# EAGLE design HARE - 3PDT Breakout Schematic v1.0 (EAGLE 8.4.1)
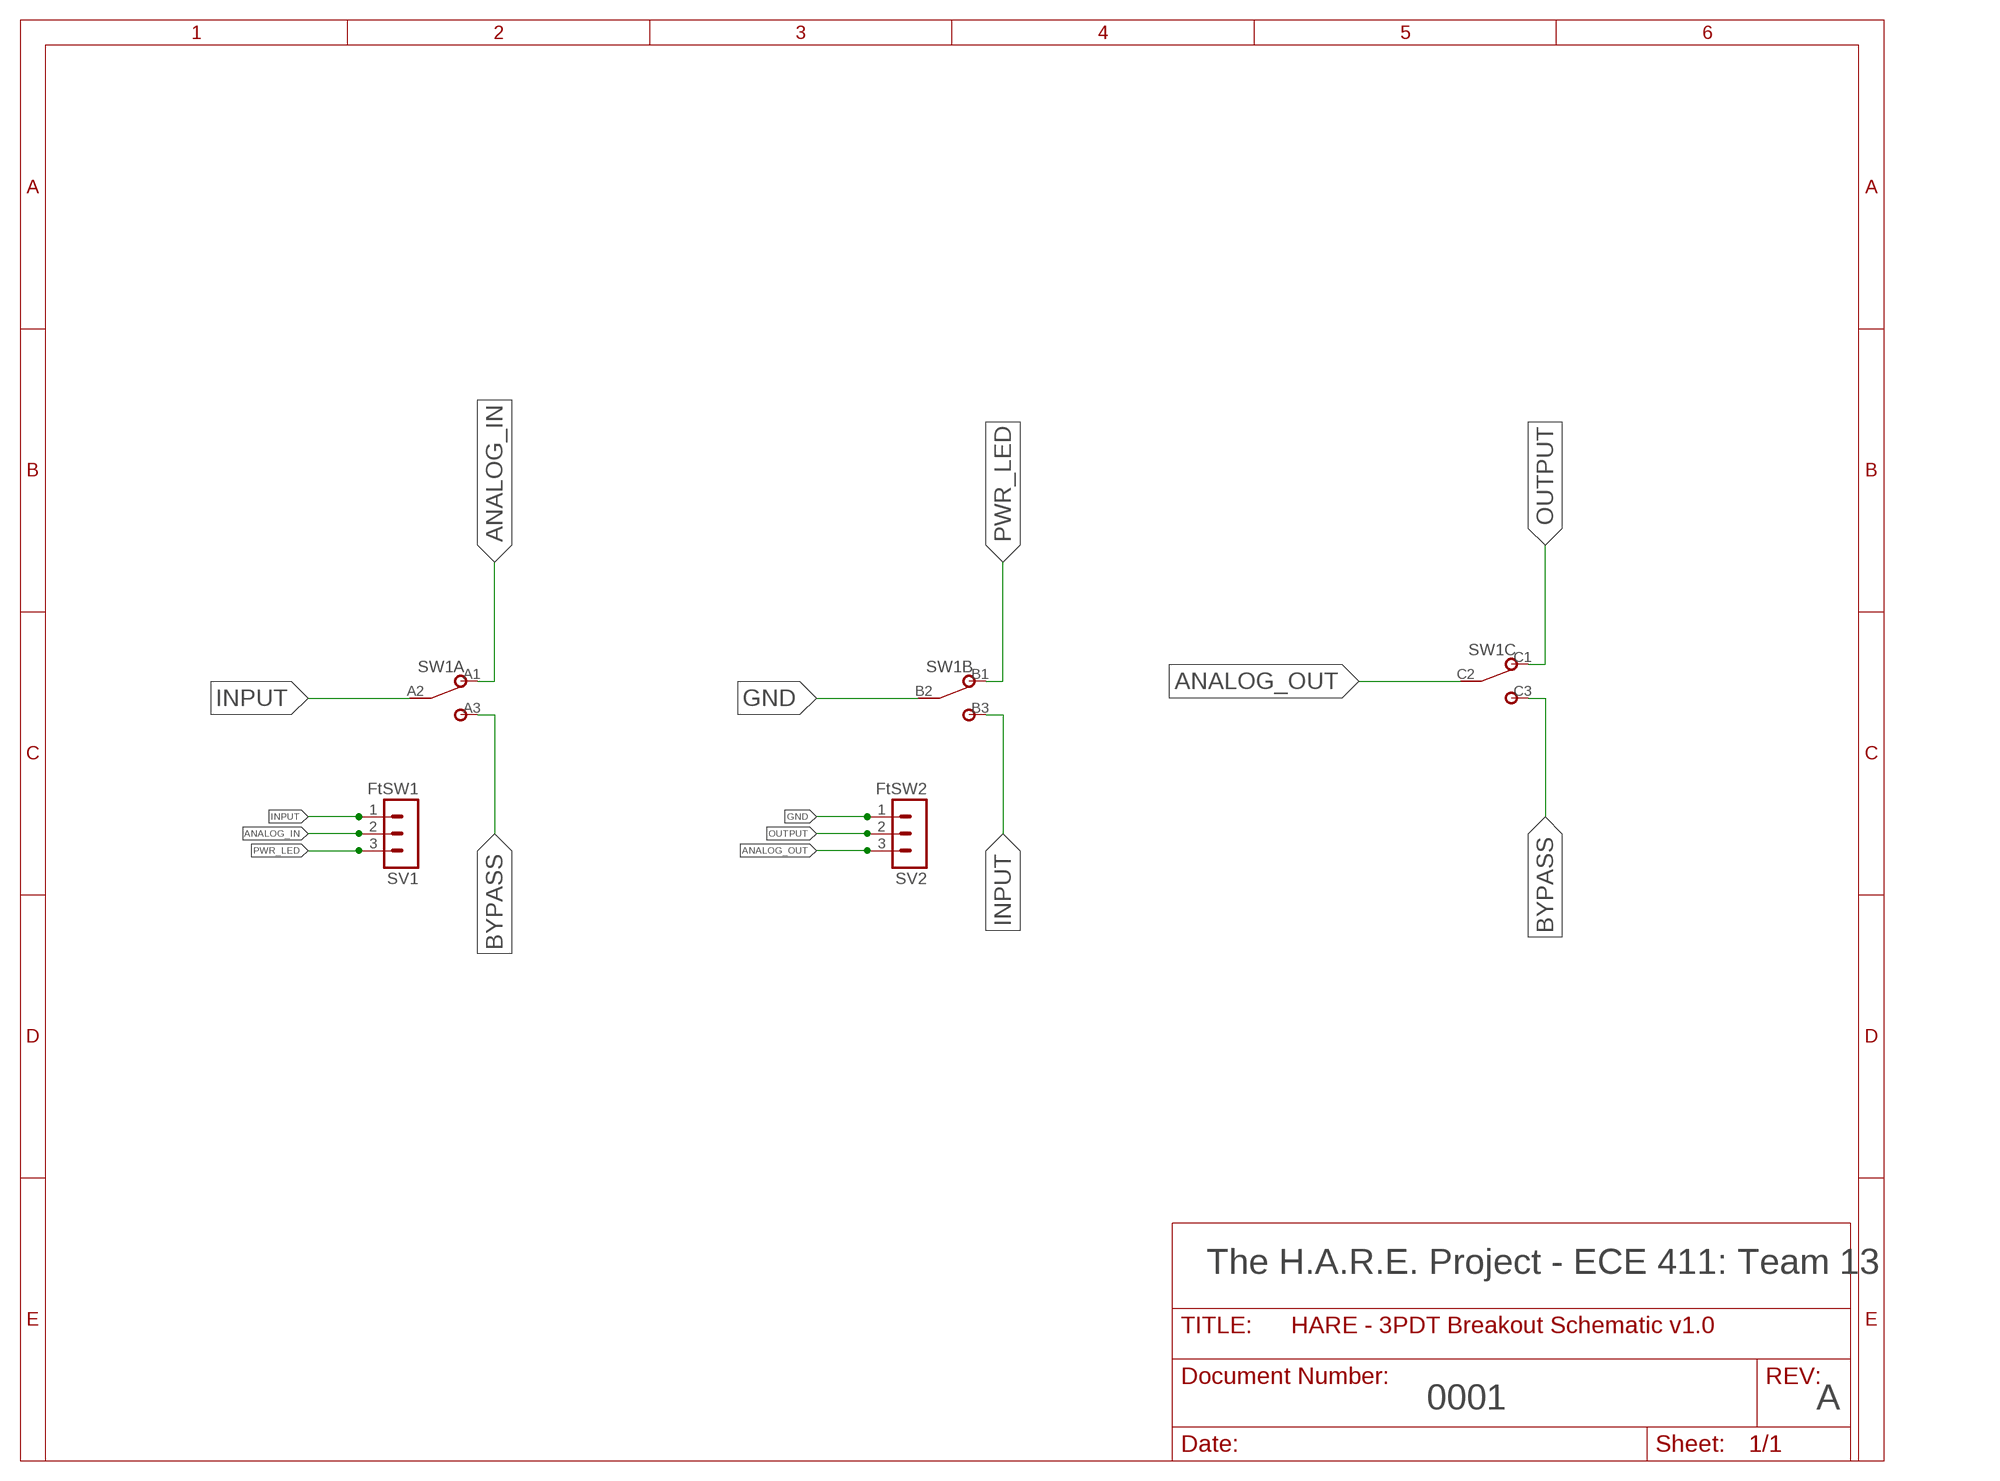
[diagram p0: schematic, sheet 1]

## Parts
SV1  FtSW1  MA03-1  [MA03-1]
SV2  FtSW2  MA03-1  [MA03-1]
SW1  3PDTBLUE  [CHINABLUE]

## Nets
ANALOG_IN: SV1.2 SW1.A1
ANALOG_OUT: SV2.3 SW1.C2
BYPASS: SW1.A3 SW1.C3
GND: SV2.1 SW1.B2
INPUT: SV1.1 SW1.A2 SW1.B3
OUTPUT: SV2.2 SW1.C1
PWR_LED: SV1.3 SW1.B1

## Notes on the sheet
- The H.A.R.E. Project - ECE 411: Team 13
- 0001 | A

## Library data of the parts
SV1 SV2 = con-lstb:MA03-1: PIN HEADER; OC_FARNELL: unknown; OC_NEWARK: unknown
SW1 = gm-switches:3PDT

## Board
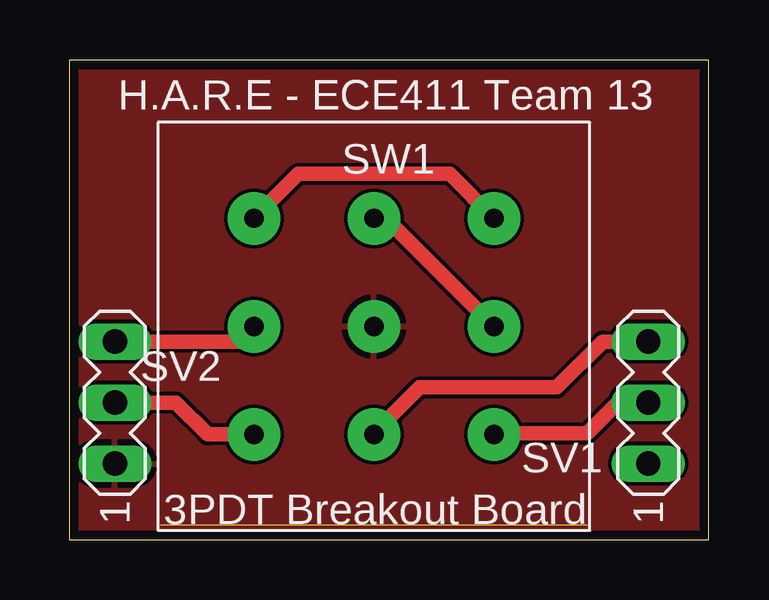
[diagram p1: board, top side]
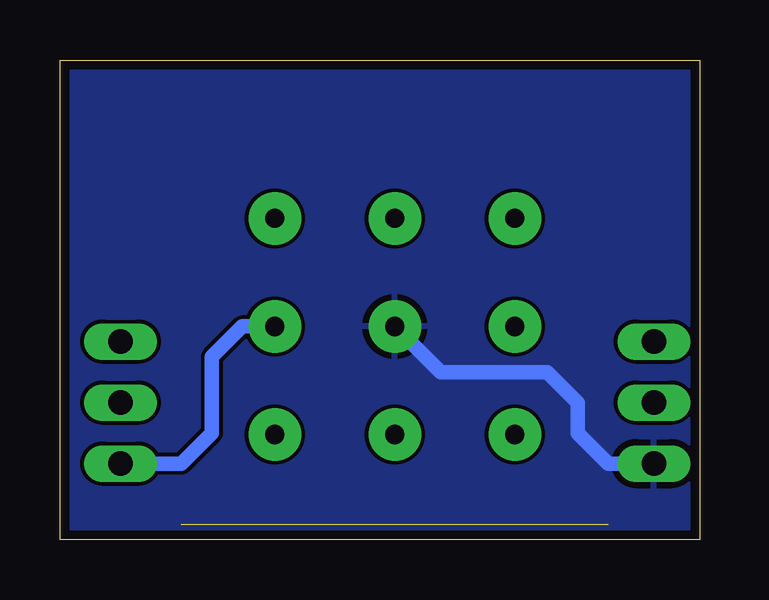
[diagram p2: board, bottom side, seen from below]

Size 26.65 x 19.99 mm. Coordinates in mm from the lower left corner, seen from the top.
Outline: 0,0 26.65,0 26.65,19.99 0,19.99 0,0
Copper layers (1*16): Top 0.0356mm / dielectric 1.5011mm / Bottom 0.0356mm
Design rules "oshpark-2layer": minimum track width 6mil, minimum drill 13mil, track to track 6mil, track to pad 6mil, pad to pad 6mil, via to via 6mil, smd to smd 6mil, copper to edge 15mil, drill to drill 6mil, minimum pad ring 7mil, minimum via ring 7mil, stop-mask expansion 2.5mil, vias tented up to drill 0mil, thermal gap 10mil

### Footprints (pad centres in the part's own frame; a part is rotated, then mirrored left to right if it is on the bottom)
MA03-1 = drill 1.016 long: 1 -2.54,0; 2 0,0; 3 2.54,0
CHINABLUE = drill 0.8 pad 2.184: A1 -5,4.5; A2 -5,0; A3 -5,-4.5; B1 0,4.5; B2 0,0; B3 0,-4.5; C1 5,4.5; C2 5,0; C3 5,-4.5

### Placement (x,y rotation side)
SV1  24.13,5.71 90 top
SV2  1.91,5.71 90 top
SW1  12.7,8.89 180 top

### Tracks (layer width: path | path; a pad name or v marks a point on that pad's centre or on a via)
ANALOG_IN
  Top 0.61: SW1.A1 17.76,4.45 21.59,4.45 22.86,5.71 SV1.2
ANALOG_OUT
  Top 0.61: SW1.C2 7.07,8.26 SV2.3
BYPASS
  Top 0.61: SW1.A3 15.85,15.24 9.55,15.24 SW1.C3
GND
  Bottom 0.61: SV2.1 3.81,3.17 5.08,4.45 5.08,5.71 6.35,6.99 10.8,6.99 SW1.B2
  pour Bottom: 0,0 0,20.07 26.67,20.07 26.67,0
  pour Top: 0,0 0,20.07 26.67,20.07 26.67,0
INPUT
  Top 0.61: SW1.B3 13.2,13.39 SW1.A2
  Bottom 0.61: SW1.A2 19.05,8.89 20.32,7.62 20.32,4.45 21.59,3.17 SV1.1
N$1
  pour Bottom (rank 2): 0.13,19.94 0.13,0.13 26.54,0.13 26.54,19.94
N$2  (1 unrouted)
OUTPUT
  Top 0.61: SW1.C1 5.77,4.39 4.45,5.71 SV2.2
PWR_LED
  Top 0.61: SW1.B1 12.7,4.45 14.61,6.35 20.32,6.35 22.23,8.26 SV1.3

### Text on the board
tNames: H.A.R.E - ECE411 Team 13 | 3PDT Breakout Board